# EAGLE schematic CursorKeypad (EAGLE 7.4.1)
Cursor Keypad Simple 5 Button cursor keys with debounce
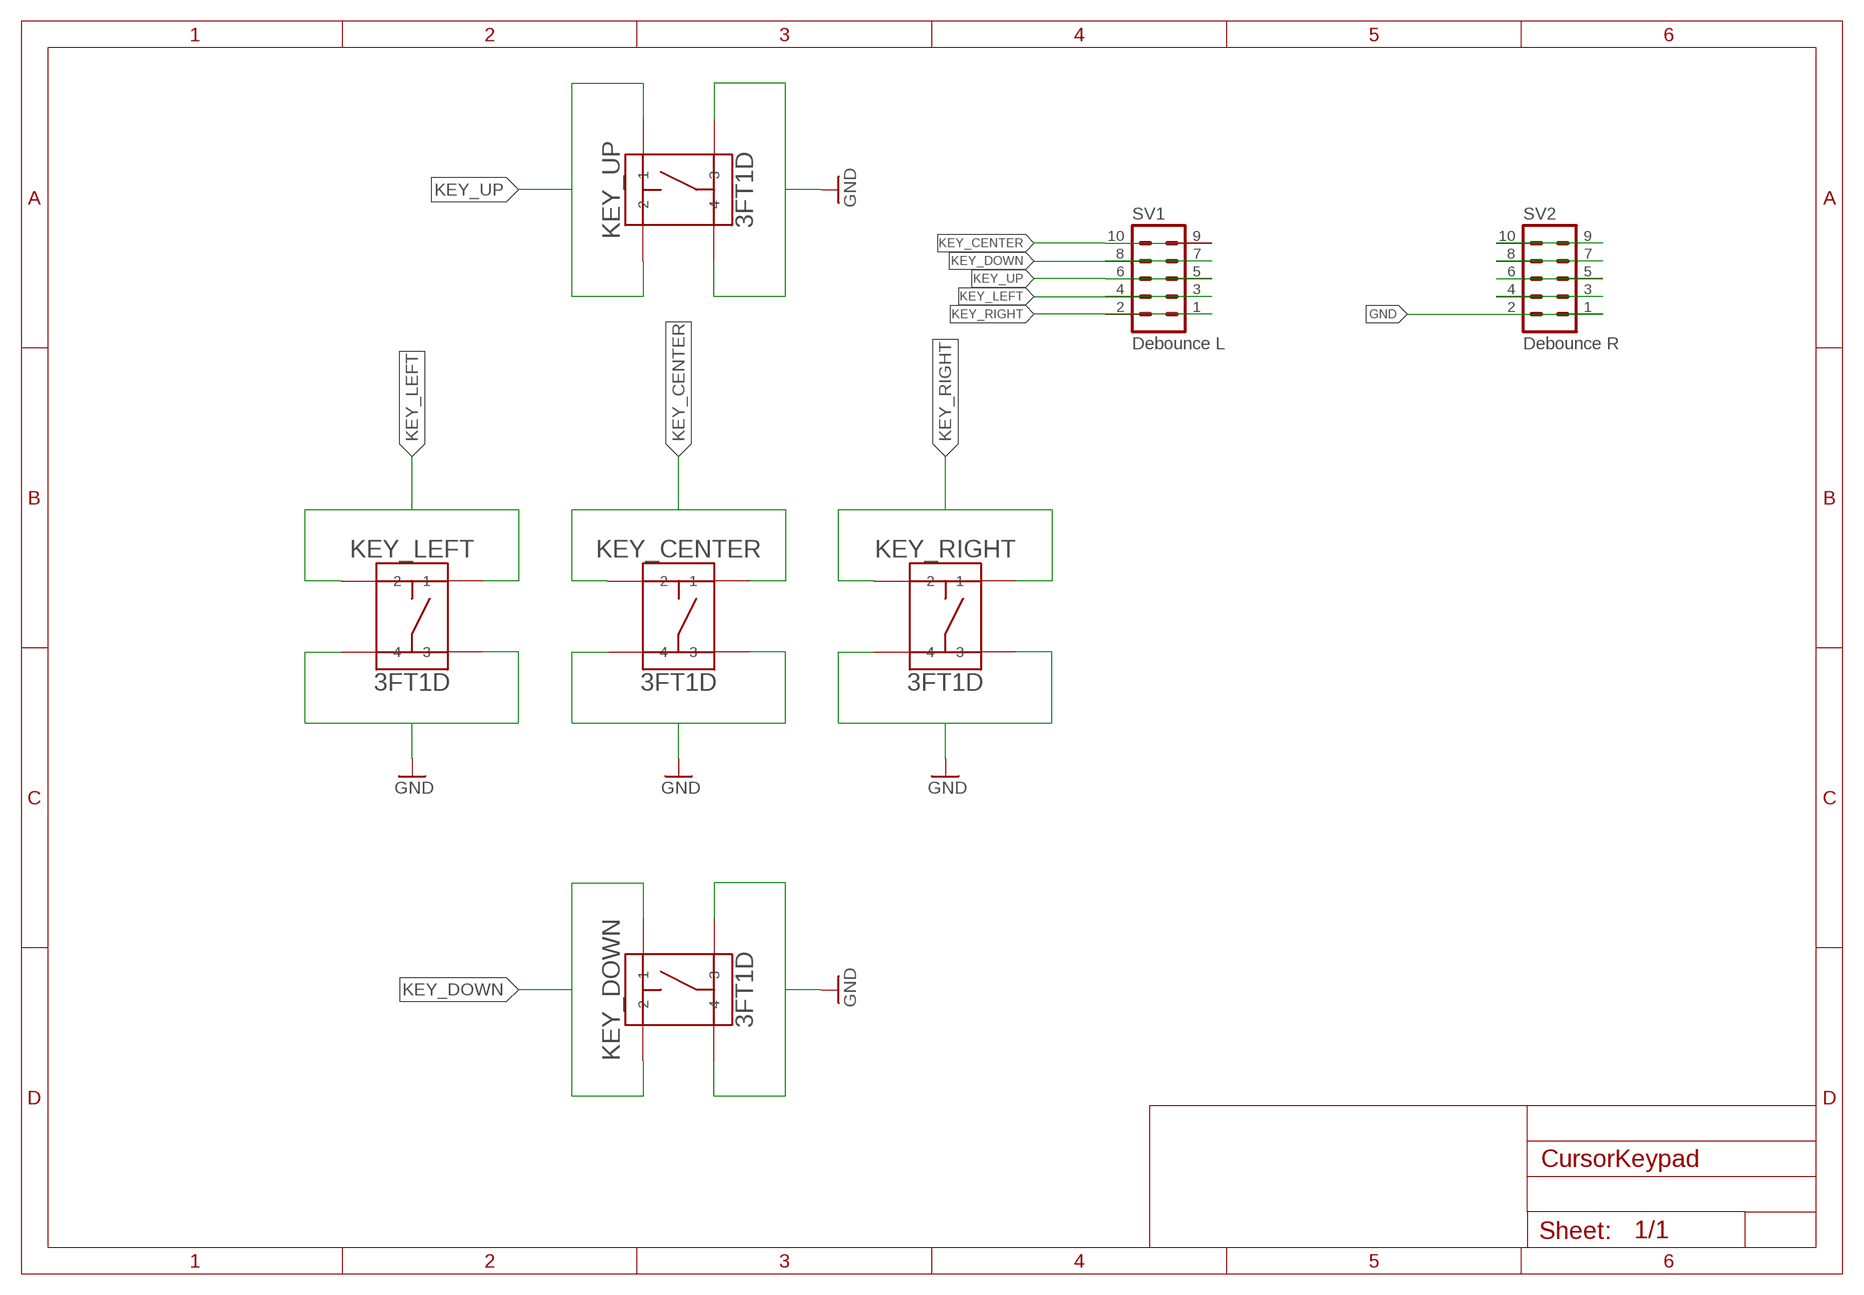
[diagram p0: schematic, sheet 1]

## Parts
KEY_CENTER  3FT1D  [3FT]
KEY_DOWN  3FT1D  [3FT]
KEY_LEFT  3FT1D  [3FT]
KEY_RIGHT  3FT1D  [3FT]
KEY_UP  3FT1D  [3FT]
SV1  Debounce L  MA05-2  [MA05-2]
SV2  Debounce R  MA05-2  [MA05-2]

## Nets
GND [Supply]: KEY_CENTER.P$3 KEY_CENTER.P$4 KEY_DOWN.P$3 KEY_DOWN.P$4 KEY_LEFT.P$3 KEY_LEFT.P$4 KEY_RIGHT.P$3 KEY_RIGHT.P$4 KEY_UP.P$3 KEY_UP.P$4 SV2.1 SV2.2
KEY_CENTER: KEY_CENTER.P$1 KEY_CENTER.P$2 SV1.9 SV1.10
KEY_DOWN: KEY_DOWN.P$1 KEY_DOWN.P$2 SV1.7 SV1.8
KEY_LEFT: KEY_LEFT.P$1 KEY_LEFT.P$2 SV1.3 SV1.4
KEY_RIGHT: KEY_RIGHT.P$1 KEY_RIGHT.P$2 SV1.1 SV1.2
KEY_UP: KEY_UP.P$1 KEY_UP.P$2 SV1.5 SV1.6
N$6: SV2.9 SV2.10
N$7: SV2.7 SV2.8
N$8: SV2.5 SV2.6
N$9: SV2.3 SV2.4

## Library data of the parts
KEY_CENTER KEY_DOWN KEY_LEFT KEY_RIGHT KEY_UP = mec switches:3FT1D: Mulitmec - 3FT1D <http://www.mec.dk/statisk.php4?id=504> Switch 3F - Through Hole with basic matt cover http://www.mec.dk
SV1 SV2 = con-lstb:MA05-2: PIN HEADER; OC_FARNELL: unknown; OC_NEWARK: unknown

## Net classes
0 default: width 0.3 mm
1 Supply: width 0.762 mm